# Altium schematic sheet upgrade.SchDoc
size A4; SheetNumber: 7; SheetTotal: 8
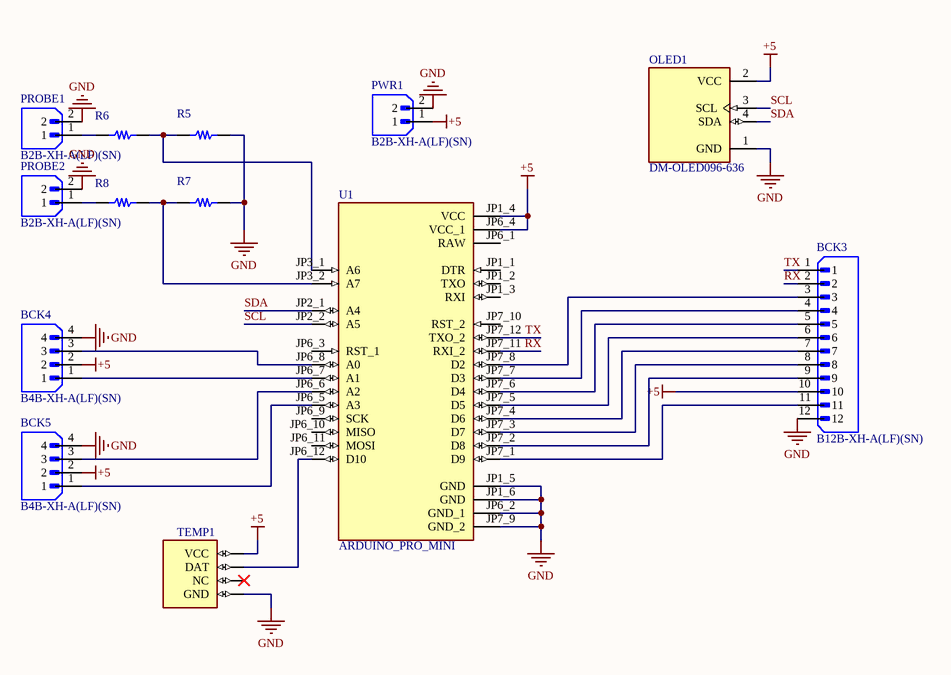
[diagram p0: upgrade.SchDoc]

## Parts
BCK3  B12B-XH-A(LF)(SN)  [JST_B12B-XH-A(LF)(SN)]
BCK4  B4B-XH-A(LF)(SN)  [JST_B4B-XH-A(LF)(SN)]
BCK5  B4B-XH-A(LF)(SN)  [JST_B4B-XH-A(LF)(SN)]
OLED1  DM-OLED096-636  [MODULE_DM-OLED096-636]
PROBE1  B2B-XH-A(LF)(SN)  [JST_B2B-XH-A(LF)(SN)]
PROBE2  B2B-XH-A(LF)(SN)  [JST_B2B-XH-A(LF)(SN)]
PWR1  B2B-XH-A(LF)(SN)  [JST_B2B-XH-A(LF)(SN)]
R5  generic_res  [generic_res_footprint]  (value not drawn)
R6  generic_res  [generic_res_footprint]  (value not drawn)
R7  generic_res  [generic_res_footprint]  (value not drawn)
R8  generic_res  [generic_res_footprint]  (value not drawn)
TEMP1  dht11_symbol  [dht11_footprint]  (value not drawn)
U1  ARDUINO_PRO_MINI  [MODULE_ARDUINO_PRO_MINI]

## Nets
+5: BCK3.10 BCK4.2 BCK5.2 OLED1.2(VCC) PWR1.1 TEMP1.1(VCC) U1.JP1_4(VCC) U1.JP6_4(VCC_1)
GND: BCK3.12 BCK4.4 BCK5.4 OLED1.1(GND) PROBE1.2 PROBE2.2 PWR1.2 R5.1 R7.1 TEMP1.4(GND) U1.JP1_5(GND) U1.JP1_6(GND) U1.JP6_2(GND_1) U1.JP7_9(GND_2)
RX: BCK3.2 U1.JP7_11(RXI_2)
SCL: OLED1.3(SCL) U1.JP2_2(A5)
SDA: OLED1.4(SDA) U1.JP2_1(A4)
TX: BCK3.1 U1.JP7_12(TXO_2)
NetBCK3_3: BCK3.3 U1.JP7_8(D2)
NetBCK3_4: BCK3.4 U1.JP7_7(D3)
NetBCK3_5: BCK3.5 U1.JP7_6(D4)
NetBCK3_6: BCK3.6 U1.JP7_5(D5)
NetBCK3_7: BCK3.7 U1.JP7_4(D6)
NetBCK3_8: BCK3.8 U1.JP7_3(D7)
NetBCK3_9: BCK3.9 U1.JP7_2(D8)
NetBCK3_11: BCK3.11 U1.JP7_1(D9)
NetBCK4_1: BCK4.1 U1.JP6_7(A1)
NetBCK4_3: BCK4.3 U1.JP6_8(A0)
NetBCK5_1: BCK5.1 U1.JP6_5(A3)
NetBCK5_3: BCK5.3 U1.JP6_6(A2)
NetPROBE1_1: PROBE1.1 R6.2
NetPROBE2_1: PROBE2.1 R8.2
NetR5_2: R5.2 R6.1 U1.JP3_1(A6)
NetR7_2: R7.2 R8.1 U1.JP3_2(A7)
NetTEMP1_2: TEMP1.2(DAT) U1.JP6_12(D10)

Not connected (* = marked no-connect by the designer): TEMP1 3(NC)*; U1 JP1_1(DTR) JP1_2(TXO) JP1_3(RXI) JP6_1(RAW) JP6_3(RST_1) JP6_9(SCK) JP6_10(MISO) JP6_11(MOSI) JP7_10(RST_2)

## Library data of the parts
BCK3 = CMP-398-000513-1: Connector Header Through Hole 12 position 0.098 (2.50mm); MF: JST Sales; Package: None; SnapEDA_Link: https://www.snapeda.com/parts/B12B-XH-A(LF)(SN)/JST+Sales+America+Inc./view-part/?ref=snap; Source: B12B-XH-A(LF)(SN).SchLib; Check_prices: https://www.snapeda.com/parts/B12B-XH-A(LF)(SN)/JST+Sales+America+Inc./view-part/?ref=eda; Value: *; Design Item ID: B12B-XH-A(LF)(SN); MP: B12B-XH-A(LF)(SN); Pin Count: 12; Component Type: Standard
BCK4 BCK5 = CMP-328-000000-1: Connector Header Through Hole 4 position 0.098 (2.50mm); MF: JST Sales; Pin Count: 4; Value: *; Check_prices: https://www.snapeda.com/parts/B4B-XH-A(LF)(SN)/JST+Sales+America+Inc./view-part/?ref=eda; SnapEDA_Link: https://www.snapeda.com/parts/B4B-XH-A(LF)(SN)/JST+Sales+America+Inc./view-part/?ref=snap; MP: B4B-XH-A(LF)(SN); Source: B4B-XH-A(LF)(SN).SchLib; Package: None; Component Type: Standard; Design Item ID: B4B-XH-A(LF)(SN)
OLED1 = CMP-410-000000-2: 128 X 64 Monochrome Graphic OLED Display Module; Check_prices: https://www.snapeda.com/parts/DM-OLED096-636/Display+Module/view-part/?ref=eda; Component Type: Standard; Design Item ID: DM-OLED096-636; Value: *; MF: Display Module; Pin Count: 4; SnapEDA_Link: https://www.snapeda.com/parts/DM-OLED096-636/Display+Module/view-part/?ref=snap; Source: DM-OLED096-636.SchLib; MP: DM-OLED096-636; Package: Package
PROBE1 PROBE2 PWR1 = CMP-332-000000-1: Connector Header Through Hole 2 position 0.098 (2.50mm); MF: JST Sales America Inc.; Component Type: Standard; Value: *; Check_prices: https://www.snapeda.com/parts/B2B-XH-A(LF)(SN)/JST+Sales+America+Inc./view-part/?ref=eda; Package: None; MP: B2B-XH-A(LF)(SN); SnapEDA_Link: https://www.snapeda.com/parts/B2B-XH-A(LF)(SN)/JST+Sales+America+Inc./view-part/?ref=snap; Pin Count: 2; Source: B2B-XH-A(LF)(SN).SchLib; Design Item ID: B2B-XH-A(LF)(SN)
R5-R8 = CMP-340-000000-2: Generic through hole resistor
TEMP1 = CMP-00054-3: Humidity, Temperature Digital Â±5% RH Through Hole; MF: UNIVERSAL-SOLDER Electronics Ltd; MP: DHT11; Source: DHT11.SchLib; Pin Count: 3; Component Type: Standard; Package: None; Check_prices: https://www.snapeda.com/parts/DHT11/Ersa/view-part/?ref=eda; Design Item ID: DHT11; SnapEDA_Link: https://www.snapeda.com/parts/DHT11/Ersa/view-part/?ref=snap; Value: *
U1 = CMP-412-000000-1: This board was developed for applications and installations where space is premium and projects are made as permanent set ups. Small, available in 3.3 V and 5 V versions, powered by ATmega328P.; MP: Arduino Pro Mini; Component Type: Standard; Value: *; Pin Count: 34; Check_prices: https://www.snapeda.com/parts/Arduino%20Pro%20Mini/Arduino/view-part/?ref=eda; Package: None; Design Item ID: ARDUINO_PRO_MINI; Source: ARDUINO_PRO_MINI.SchLib; MF: Arduino; SnapEDA_Link: https://www.snapeda.com/parts/Arduino%20Pro%20Mini/Arduino/view-part/?ref=snap